# EAGLE schematic prod plus l-filters v2 (EAGLE 8.0.2)
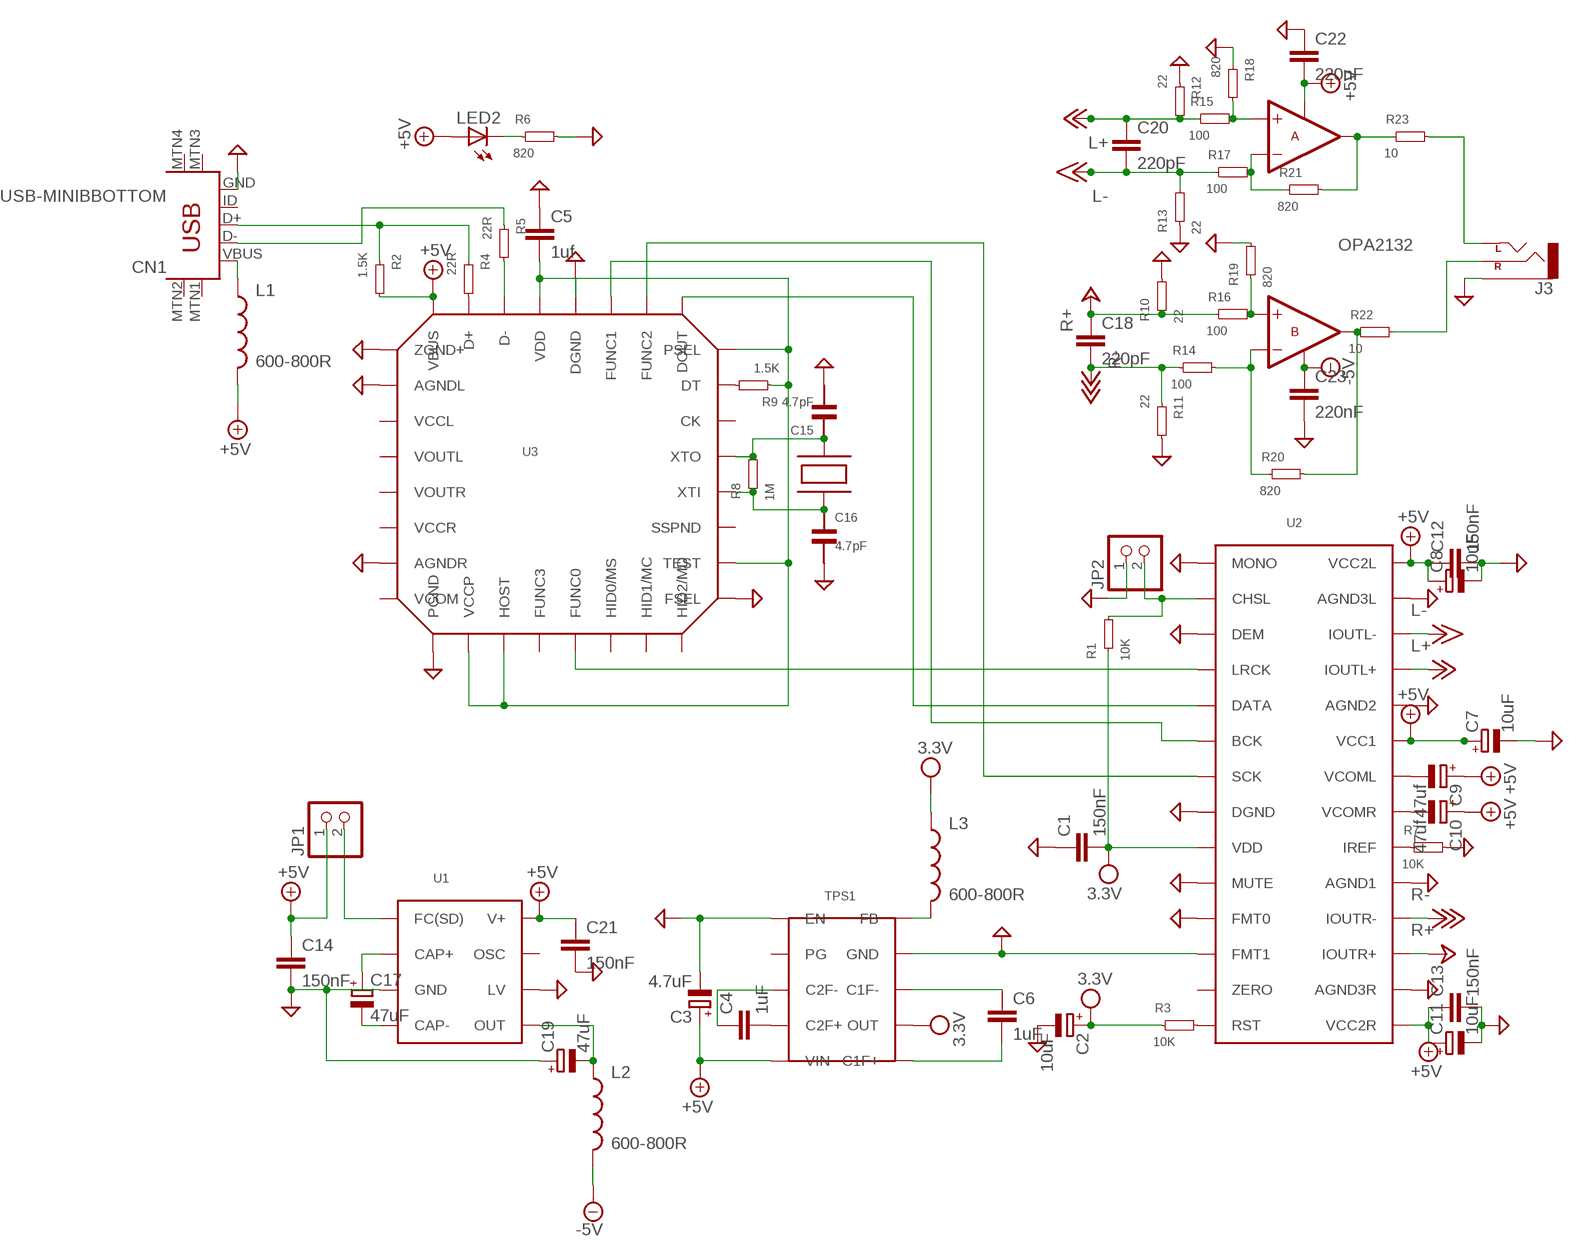
[diagram p0: schematic, sheet 1]

## Parts
C1  150nF  CAP0805  [0805]
C2  10uF  10UF/16V_PANA_M-CAP  [10UF/16V_PANA_M_CAP]
C3  4.7uF  4.7UF/50V_PANA_M-CAP  [10UF/16V_PANA_M_CAP]
C4  1uF  CAP0805  [0805]
C5  1uf  CAP0805  [0805]
C6  1uF  CAP0805  [0805]
C7  10uF  10UF/16V_PANA_M-CAP  [10UF/16V_PANA_M_CAP]
C8  10uF  10UF/16V_PANA_M-CAP  [10UF/16V_PANA_M_CAP]
C9  47uf  47UF/16V_PANA_M-CAP  [10UF/16V_PANA_M_CAP]
C10  47uf  47UF/16V_PANA_M-CAP  [10UF/16V_PANA_M_CAP]
C11  10uF  10UF/16V_PANA_M-CAP  [10UF/16V_PANA_M_CAP]
C12  150nF  CAP0805  [0805]
C13  150nF  CAP0805  [0805]
C14  150nF  CAP0805  [0805]
C15  4.7pF  4.7PF_CAPMLCC  [4.7PF_CAP]
C16  4.7pF  4.7PF_CAPMLCC  [4.7PF_CAP]
C17  47uF  47UF/16V_PANA_M-CAP  [10UF/16V_PANA_M_CAP]
C18  220pF  C-EU050-045X075  [C050-045X075]
C19  47uF  47UF/16V_PANA_M-CAP  [10UF/16V_PANA_M_CAP]
C20  220pF  C-EU050-045X075  [C050-045X075]
C21  150nF  CAP0805  [0805]
C22  220nF  22UF-6.3V-20%(0805)  [0805]
C23  220nF  22UF-6.3V-20%(0805)  [0805]
CN1  USB-MINIBBOTTOM  [USB-MINIB]
J3  AUDIO-JACKPTH  [AUDIO-JACK]
JP1  PINHD-1X2  [1X02]
JP2  PINHD-1X2  [1X02]
L1  600-800R  INDUCTOR0805-IND  [0805]
L2  600-800R  INDUCTOR0805-IND  [0805]
L3  600-800R  INDUCTOR0805-IND  [0805]
LED2  LED3MM  [LED3MM]
OPA2132  OPA2132DIP8  [DIP-8]
R1  10K  RESISTOR.125W  [1-8W_RES]
R2  1.5K  RESISTOR.125W  [1-8W_RES]
R3  10K  RESISTOR.125W  [1-8W_RES]
R4  22R  RESISTOR.125W  [1-8W_RES]
R5  22R  RESISTOR.125W  [1-8W_RES]
R6  820  RESISTOR.125W  [1-8W_RES]
R7  10K  RESISTOR.125W  [1-8W_RES]
R8  1M  RESISTOR.125W  [1-8W_RES]
R9  1.5K  RESISTOR.125W  [1-8W_RES]
R10  22  RESISTOR.125W  [1-8W_RES]
R11  22  RESISTOR.125W  [1-8W_RES]
R12  22  RESISTOR.125W  [1-8W_RES]
R13  22  RESISTOR.125W  [1-8W_RES]
R14  100  RESISTOR.125W  [1-8W_RES]
R15  100  RESISTOR.125W  [1-8W_RES]
R16  100  RESISTOR.125W  [1-8W_RES]
R17  100  RESISTOR.125W  [1-8W_RES]
R18  820  RESISTOR.125W  [1-8W_RES]
R19  820  RESISTOR.125W  [1-8W_RES]
R20  820  RESISTOR.125W  [1-8W_RES]
R21  820  RESISTOR.125W  [1-8W_RES]
R22  10  RESISTOR.125W  [1-8W_RES]
R23  10  RESISTOR.125W  [1-8W_RES]
TPS1  TPS60501DGS-10-BOTTOM  [DGS-10-BOTTOM_LYR]
U1  LM2662SO8-BOTTOM  [SOIC-8_BOTTOM-LYR]
U2  PCM1794ADB_R-PDSO-G28-BOTTOM  [DB_R-PDSO-G28-BOTTOM_LYR]
U3  PCM2707QFP-32-BOTTOM  [PJT_(QFP-32)-BOTTOM_LYR]
X1  12MHZ  CRYSTAL  [CRYSTAL]

## Nets
+5V: C3.+ C7.+ C8.+ C9.+ C10.+ C11.+ C12.1 C13.1 C14.1 C21.1 C22.2 JP1.1 L1.2 LED2.A OPA2132.8(8(+)) R2.P$2 TPS1.5(VIN) U1.8(V+) U2.15(VCC2R) U2.23(VCC1) U2.28(VCC2L) U3.24(VBUS)
+12V: C20.1 R12.P$2 R15.P$1 U2.25(IOUTL+) ; supply symbol labelled L+
+15V: C20.2 R13.P$2 R17.P$1 U2.26(IOUTL-) ; supply symbol labelled L-
+18V: C18.2 R11.P$1 R14.P$1 U2.18(IOUTR-) ; supply symbol labelled R-
+24V: C18.1 R10.P$1 R16.P$1 U2.17(IOUTR+) ; supply symbol labelled R+
-5V: C23.1 L2.2 OPA2132.4(4(-))
GND: C1.1 C2.- C3.- C5.1 C7.- C8.- C11.- C12.2 C13.2 C14.2 C15.2 C16.2 C19.+ C21.2 C22.1 C23.2 CN1.GND J3.SLEEVE JP2.1 R6.P$2 R7.P$2 R10.P$2 R11.P$2 R12.P$1 R13.P$1 R18.P$1 R19.P$2 TPS1.1(EN) TPS1.9(GND) U1.3(GND) U1.6(LV) U2.1(MONO) U2.3(DEM) U2.8(DGND) U2.10(MUTE) U2.11(FMT0) U2.12(FMT1) U2.16(AGND3R) U2.19(AGND1) U2.24(AGND2) U2.27(AGND3L) U3.1(PGND) U3.9(FSEL) U3.20(DGND) U3.25(ZGND+) U3.26(AGNDL) U3.31(AGNDR)
N$1: C5.2 R9.P$1 U3.2(VCCP) U3.3(HOST) U3.10(TEST) U3.16(PSEL) U3.21(VDD)
N$2: OPA2132.7 R20.P$2 R22.P$1
N$3: OPA2132.5 R16.P$2 R19.P$1
N$4: C9.- U2.22(VCOML)
N$5: U2.4(LRCK) U3.5(FUNC0)
N$6: J3.TIP(LEFT) R23.P$2
N$7: OPA2132.6 R14.P$2 R20.P$1
N$8: C10.- U2.21(VCOMR)
N$9: R5.P$2 U3.22(D-)
N$10: CN1.D+ R2.P$1 R4.P$1
N$11: OPA2132.3 R15.P$2 R18.P$2
N$12: LED2.K(C) R6.P$1
N$13: R3.P$2 U2.14(RST)
N$14: C15.1 R8.P$2 U3.13(XTO) X1.2
N$15: C4.2 TPS1.4(C2F+)
N$16: C4.1 TPS1.3(C2F-)
N$17: C6.2 TPS1.6(C1F+)
N$18: C6.1 TPS1.8(C1F-)
N$19: C16.1 R8.P$1 U3.12(XTI) X1.1
N$20: CN1.VBUS L1.1
N$21: CN1.D- R5.P$1
N$22: U2.6(BCK) U3.19(FUNC1)
N$23: U2.5(DATA) U3.17(DOUT)
N$24: U2.7(SCK) U3.18(FUNC2)
N$25: R7.P$1 U2.20(IREF)
N$26: R9.P$2 U3.15(DT)
N$27: R4.P$2 U3.23(D+)
N$28: C19.- L2.1 U1.5(OUT)
N$31: OPA2132.2 R17.P$2 R21.P$1
N$32: JP2.2 R1.P$2 U2.2(CHSL)
N$33: JP1.2 U1.1(FC(SD))
N$34: J3.RING(RIGHT) R22.P$2
N$35: L3.2 TPS1.10(FB)
N$36: OPA2132.1 R21.P$2 R23.P$1
N$44: C17.+ U1.2(CAP+)
N$45: C17.- U1.4(CAP-)
VCC: C1.2 C2.+ L3.1 R1.P$1 R3.P$1 TPS1.7(OUT) U2.9(VDD) ; supply symbol labelled 3.3V
Unconnected: CN1.ID CN1.MTN1 CN1.MTN2 CN1.MTN3 CN1.MTN4 TPS1.2(PG) U1.7(OSC) U2.13(ZERO) U3.4(FUNC3) U3.6(HID0/MS) U3.7(HID1/MC) U3.8(HID2/MD) U3.11(SSPND) U3.14(CK) U3.27(VCCL) U3.28(VOUTL) U3.29(VOUTR) U3.30(VCCR) U3.32(VCOM)

## Library data of the parts
C1 C4-C6 C12-C14 C21 = SparkFun-Capacitors:CAP: Capacitor Standard 0603 ceramic capacitor, and 0.1" leaded capacitor.
C2 C7 C8 C11 = joe's favorites:10UF/16V_PANA_M-CAP
C3 = joe's favorites:4.7UF/50V_PANA_M-CAP
C9 C10 C17 C19 = joe's favorites:47UF/16V_PANA_M-CAP
C15 C16 = joe's favorites:4.7PF_CAP
C18 C20 = resistor:C-EU: CAPACITOR, European symbol
C22 C23 = SparkFun-Capacitors:22UF-6.3V-20%(0805): CAP-08402 Ceramic; PROD_ID: CAP-08402; VALUE: 22uF
CN1 = SparkFun-Connectors:USB-MINIB: Mini-USB "B" connector with 5th pin broken out. Created new symbol breaking out 5th "ID" pin in mini/micro USB connector spec. See: http://en.wikipedia.org/wiki/Mini_usb#Cables. Uses same footprint as 4-pin symbol. Also added pins to connect to mounting / shield pads if required (probably not generally needed as signals aren't shielded once they leave the connector).
J3 = SparkFun-Connectors:AUDIO-JACK: 3.5mm Audio Jack Simple 3.5mm common PCB mount audio jack. Variant PTH is our storefront SKU PRT-08032
JP1 JP2 = pinhead:PINHD-1X2: PIN HEADER
L1-L3 = SparkFun-Passives:INDUCTOR: Inductors Basic Inductor/Choke - 0603 and 1206. Footprints are not proven and vary greatly between part numbers. INDUCTOR POWER 3.3UH 4.0A SMD 0.197" L x 0.197" W x 0.177" H (5.00mm x 5.00mm x 4.50mm); PROD_ID: NDUC-13076
LED2 = led:LED: LED OSRAM: - CHIPLED LG R971, LG N971, LY N971, LG Q971, LY Q971, LO R971, LY R971 LH N974, LH R974 LS Q976, LO Q976, LY Q976 LO Q996 - Hyper CHIPLED LW Q18S LB Q993, LB Q99A, LB R99A - SideLED LS A670, LO A670, LY A670, LG A670, LP A670 LB A673, LV A673, LT A673, LW A673 LH A674 LY A675 LS A676, LA A676, LO A676, LY A676, LW A676 LS A679, LY A679, LG A679 - Hyper Micro SIDELED® LS Y876, LA Y876, LO Y876, LY Y876 LT Y87S - SmartLED LW L88C, LW L88S LB L89C, LB L89S, LG L890 LS L89K, LO L89K, LY L89K LS L896, LA L896, LO L896, LY L896 - TOPLED LS T670, LO T670, LY T670, LG T670, LP T670 LSG T670, LSP T670, LSY T670, LOP T670, LYG T670 LG T671, LOG T671, LSG T671 LB T673, LV T673, LT T673, LW T673 LH T674 LS T676, LA T676, LO T676, LY T676, LB T676, LH T676, LSB T676, LW T676 LB T67C, LV T67C, LT T67C, LS T67K, LO T67K, LY T67K, LW E67C LS E67B, LA E67B, LO E67B, LY E67B, LB E67C, LV E67C, LT E67C LW T67C LS T679, LY T679, LG T679 LS T770, LO T770, LY T770, LG T770, LP T770 LB T773, LV T773, LT T773, LW T773 LH T774 LS E675, LA E675, LY E675, LS T675 LS T776, LA T776, LO T776, LY T776, LB T776 LHGB T686 LT T68C, LB T68C - Hyper Mini TOPLED® LB M676 - Mini TOPLED Santana® LG M470 LS M47K, LO M47K, LY M47K Source: http://www.osram.convergy.de LUXEON: - LUMILED® LXK2-PW12-R00, LXK2-PW12-S00, LXK2-PW14-U00, LXK2-PW14-V00 LXK2-PM12-R00, LXK2-PM12-S00, LXK2-PM14-U00 LXK2-PE12-Q00, LXK2-PE12-R00, LXK2-PE12-S00, LXK2-PE14-T00, LXK2-PE14-U00 LXK2-PB12-K00, LXK2-PB12-L00, LXK2-PB12-M00, LXK2-PB14-N00, LXK2-PB14-P00, LXK2-PB14-Q00 LXK2-PR12-L00, LXK2-PR12-M00, LXK2-PR14-Q00, LXK2-PR14-R00 LXK2-PD12-Q00, LXK2-PD12-R00, LXK2-PD12-S00 LXK2-PH12-R00, LXK2-PH12-S00 LXK2-PL12-P00, LXK2-PL12-Q00, LXK2-PL12-R00 Source: www.luxeon.com KINGBRIGHT: KA-3528ASYC Source: www.kingbright.com
OPA2132 = Opamps and Buffers:OPA2132
R1-R23 = joe's favorites:RESISTOR
TPS1 = Audio ICs:TPS60501
U1 = Audio ICs:LM2662
U2 = Audio ICs:PCM1794A
U3 = Audio ICs:PCM2707
X1 = joe's favorites:CRYSTAL